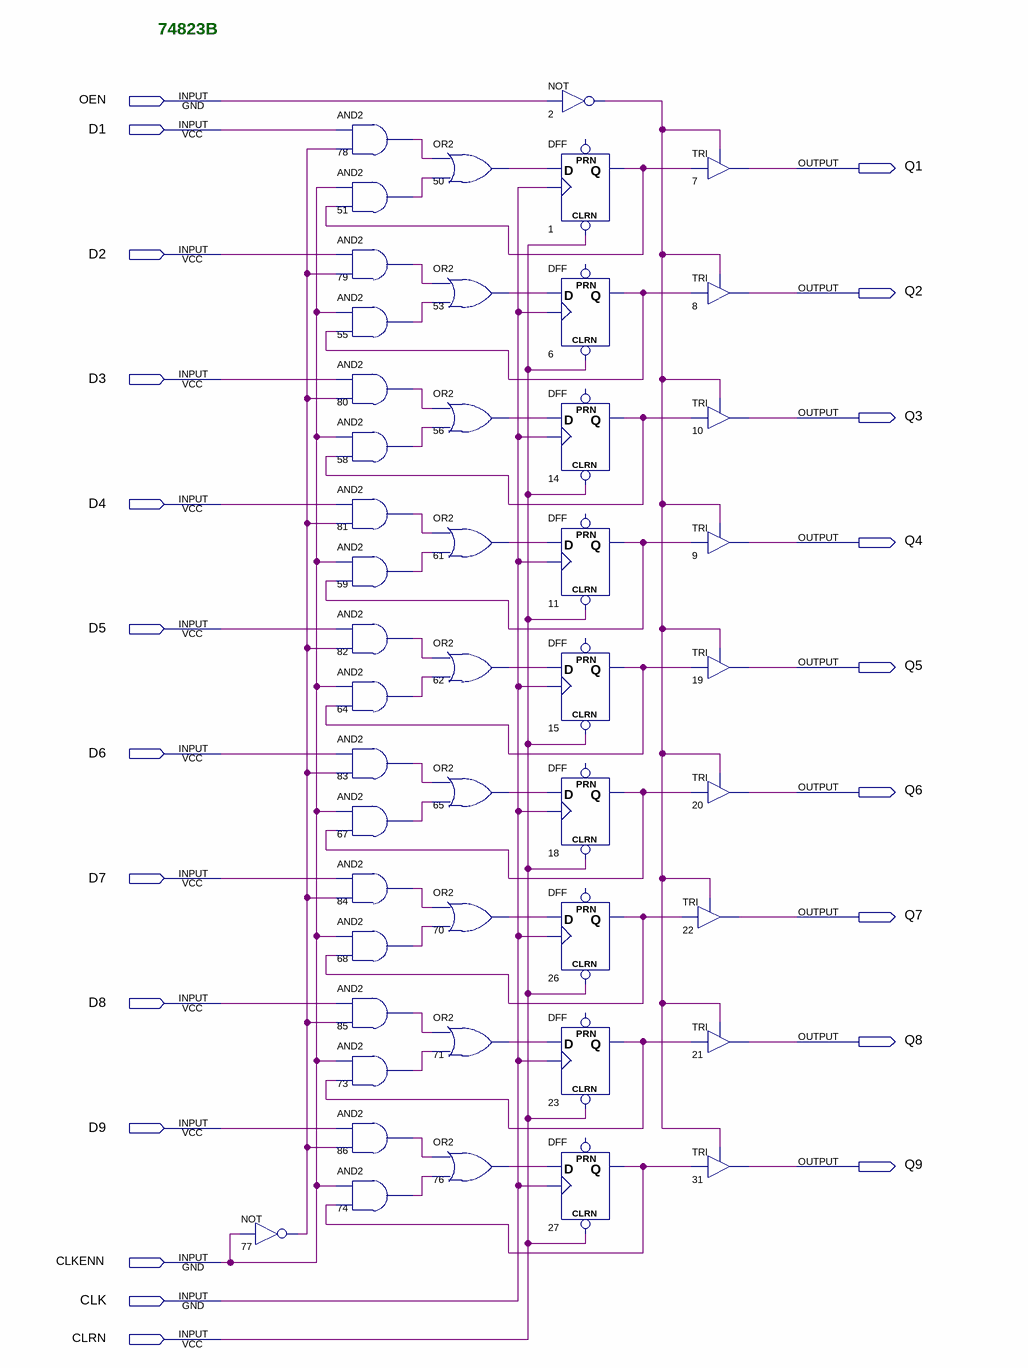
[diagram p0: schematic sheet]
// Quartus schematic 74823b.bdf as structural Verilog: 47 symbols, 22 pins
module \74823b  (
  input  OEN,
  input  D1,
  input  D2,
  input  D3,
  input  D4,
  input  D5,
  input  D6,
  input  D7,
  input  D8,
  input  D9,
  input  CLKENN,
  input  CLK,
  input  CLRN,
  output Q1,
  output Q2,
  output Q3,
  output Q4,
  output Q5,
  output Q6,
  output Q7,
  output Q8,
  output Q9
);

  wire n1_q, n2_out, n6_q, n11_q, n14_q, n15_q, n18_q, n23_q, n26_q, n27_q, n50_out, n51_out, n53_out,
       n55_out, n56_out, n58_out, n59_out, n61_out, n62_out, n64_out, n65_out, n67_out, n68_out, n70_out,
       n71_out, n73_out, n74_out, n76_out, n77_out, n78_out, n79_out, n80_out, n81_out, n82_out, n83_out,
       n84_out, n85_out, n86_out;

  not u_77 (n77_out, CLKENN);
  and u_78 (n78_out, D1, n77_out);
  and u_51 (n51_out, CLKENN, n1_q);
  and u_79 (n79_out, D2, n77_out);
  and u_55 (n55_out, CLKENN, n6_q);
  and u_80 (n80_out, D3, n77_out);
  and u_58 (n58_out, CLKENN, n14_q);
  and u_81 (n81_out, D4, n77_out);
  and u_59 (n59_out, CLKENN, n11_q);
  and u_82 (n82_out, D5, n77_out);
  and u_64 (n64_out, CLKENN, n15_q);
  and u_83 (n83_out, D6, n77_out);
  and u_67 (n67_out, CLKENN, n18_q);
  and u_84 (n84_out, D7, n77_out);
  and u_68 (n68_out, CLKENN, n26_q);
  and u_85 (n85_out, D8, n77_out);
  and u_73 (n73_out, CLKENN, n23_q);
  and u_86 (n86_out, D9, n77_out);
  and u_74 (n74_out, CLKENN, n27_q);
  or u_50 (n50_out, n78_out, n51_out);
  or u_53 (n53_out, n79_out, n55_out);
  or u_56 (n56_out, n80_out, n58_out);
  or u_61 (n61_out, n81_out, n59_out);
  or u_62 (n62_out, n82_out, n64_out);
  or u_65 (n65_out, n83_out, n67_out);
  or u_70 (n70_out, n84_out, n68_out);
  or u_71 (n71_out, n85_out, n73_out);
  or u_76 (n76_out, n86_out, n74_out);
  not u_2 (n2_out, OEN);
  DFF u_1 (.CLRN(CLRN), .CLK(CLK), .D(n50_out), .Q(n1_q));  // open: PRN
  DFF u_6 (.CLRN(CLRN), .CLK(CLK), .D(n53_out), .Q(n6_q));  // open: PRN
  DFF u_14 (.CLRN(CLRN), .CLK(CLK), .D(n56_out), .Q(n14_q));  // open: PRN
  DFF u_11 (.CLRN(CLRN), .CLK(CLK), .D(n61_out), .Q(n11_q));  // open: PRN
  DFF u_15 (.CLRN(CLRN), .CLK(CLK), .D(n62_out), .Q(n15_q));  // open: PRN
  DFF u_18 (.CLRN(CLRN), .CLK(CLK), .D(n65_out), .Q(n18_q));  // open: PRN
  DFF u_26 (.CLRN(CLRN), .CLK(CLK), .D(n70_out), .Q(n26_q));  // open: PRN
  DFF u_23 (.CLRN(CLRN), .CLK(CLK), .D(n71_out), .Q(n23_q));  // open: PRN
  DFF u_27 (.CLRN(CLRN), .CLK(CLK), .D(n76_out), .Q(n27_q));  // open: PRN
  TRI u_22 (.IN(n26_q), .OE(n2_out), .OUT(Q7));
  TRI u_7 (.IN(n1_q), .OE(n2_out), .OUT(Q1));
  TRI u_8 (.IN(n6_q), .OE(n2_out), .OUT(Q2));
  TRI u_10 (.IN(n14_q), .OE(n2_out), .OUT(Q3));
  TRI u_9 (.IN(n11_q), .OE(n2_out), .OUT(Q4));
  TRI u_19 (.IN(n15_q), .OE(n2_out), .OUT(Q5));
  TRI u_20 (.IN(n18_q), .OE(n2_out), .OUT(Q6));
  TRI u_21 (.IN(n23_q), .OE(n2_out), .OUT(Q8));
  TRI u_31 (.IN(n27_q), .OE(n2_out), .OUT(Q9));

  // Notes on the sheet:
  //   74823B
endmodule
